# Altium project Remote_sensor.PRJPCB
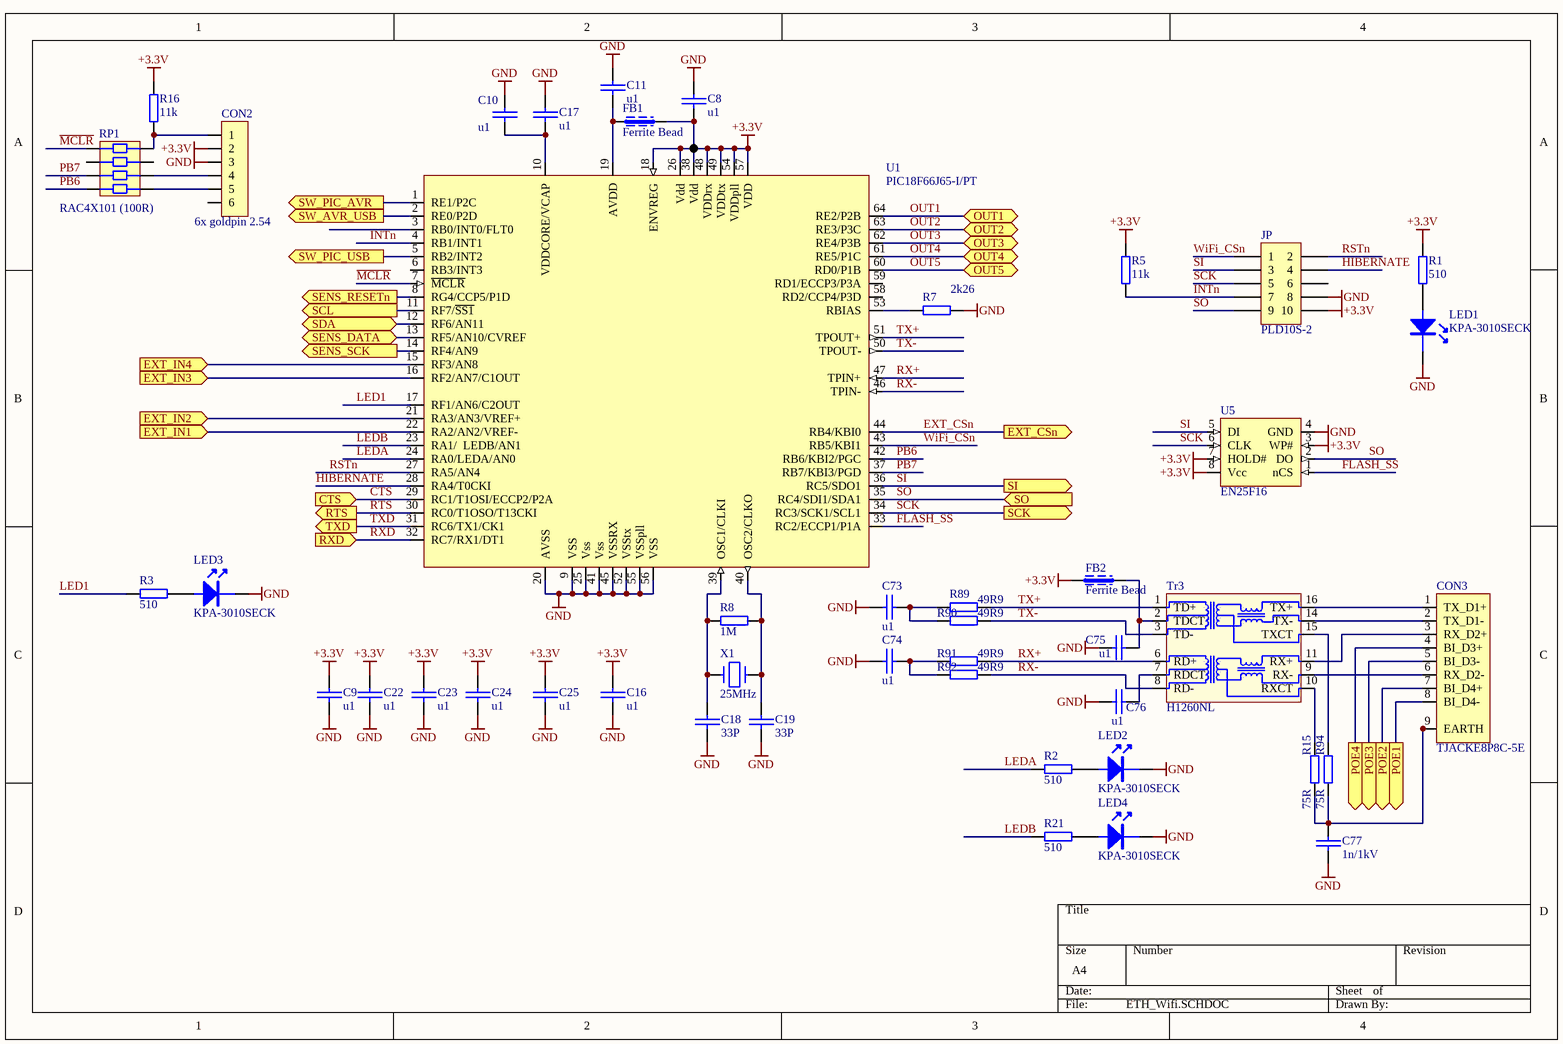
[diagram p0: ETH_Wifi.SCHDOC]
6 sheets, 136 parts. Net scope: hierarchical (ports join the sheet entries above them; power ports are global).
Board file: Weather_Station_ETH.PcbDoc
Sheets:
  ETH_Wifi.SCHDOC
  USB.SchDoc
  supply.SchDoc
  sensors.SchDoc
  IO_SchDoc.SchDoc
  AVR.SchDoc

## Sheet ETH_Wifi.SCHDOC
size A4; SheetNumber: 0; SheetTotal: 0

### Parts
C8  u1  [0603]
C9  u1  [0603]
C10  u1  [0603]
C11  u1  [0603]
C16  u1  [0603]
C17  u1  [0603]
C18  33P  [0603]
C19  33P  [0603]
C22  u1  [0603]
C23  u1  [0603]
C24  u1  [0603]
C25  u1  [0603]
C73  u1  [0603]
C74  u1  [0603]
C75  u1  [0603]
C76  u1  [0603]
C77  1n/1kV  [cap_ceram]
CON2  6x goldpin 2.54  [SIP6]
CON3  TJACKE8P8C-5E  [TJACKE8P8C-5E]
FB1  Ferrite Bead  [0603]
FB2  Ferrite Bead  [0603]
JP  PLD10S-2  [HEADER5X2]
LED1  KPA-3010SECK  [LED_KPA3010]
LED2  KPA-3010SECK  [LED_KPA3010]
LED3  KPA-3010SECK  [LED_KPA3010]
LED4  KPA-3010SECK  [LED_KPA3010]
R1  510  [0603]
R2  510  [0603]
R3  510  [0603]
R5  11k  [0603]
R7  2k26  [0603]
R8  1M  [0603]
R15  75R  [0603]
R16  11k  [0603]
R21  510  [0603]
R89  49R9  [0603]
R90  49R9  [0603]
R91  49R9  [0603]
R92  49R9  [0603]
R94  75R  [0603]
RP1  RAC4X101 (100R)  [CAY-16]
Tr3  H1260NL  [H1260NL]
U1  PIC18F66J65-I/PT  [TQFP64-MAX]
U5  EN25F16  [SO-8L]
X1  25MHz  [HC-49SM]

### Ports
CTS (in), EXT_CSn (out), EXT_IN1 (in), EXT_IN2 (in), EXT_IN3 (in), EXT_IN4 (in), OUT1 (bidir), OUT2 (bidir), OUT3 (bidir), OUT4 (bidir), OUT5 (bidir), POE1 (out), POE2 (out), POE3 (out), POE4 (out), RTS (out), RXD (in), SCK (out), SCL (out), SDA (bidir), SENS_DATA (bidir), SENS_RESETn (out), SENS_SCK (out), SI (out), SO (in), SW_AVR_USB (out), SW_PIC_AVR (out), SW_PIC_USB (out), TXD (out)

### Nets
+3.3V: C8.2 C9.2 C16.1 C22.1 C23.1 C24.1 C25.1 CON2.2 FB1.2 FB2.1 JP.10 R1.1 R5.2 R16.2 U1.18(ENVREG) U1.26(Vdd) U1.38(Vdd) U1.48(VDDrx) U1.49(VDDtx) U1.54(VDDpll) U1.57(VDD) U5.3(WP#) U5.7(HOLD#) U5.8(Vcc)
GND: C8.1 C9.1 C10.1 C11.1 C16.2 C17.1 C18.1 C19.1 C22.2 C23.2 C24.2 C25.2 C73.1 C74.1 C75.1 C76.1 C77.2 CON2.3 JP.8 LED1.K LED2.K LED3.K LED4.K R7.2 U1.9(VSS) U1.20(AVSS) U1.25(Vss) U1.41(Vss) U1.45(VSSRX) U1.52(VSStx) U1.55(VSSpll) U1.56(VSS) U5.4(GND)
CTS: U1.29(RC1/T1OSI/ECCP2/P2A) ; port CTS
EXT_CSn: U1.44(RB4/KBI0) ; port EXT_CSn
FLASH_SS: U1.33(RC2/ECCP1/P1A) U5.1(nCS)
HIBERNATE: JP.4 U1.28(RA4/T0CKI)
INTn: JP.7 R5.1 U1.4(RB1/INT1)
LED1: R3.2 U1.17(RF1/AN6/C2OUT)
LEDA: R2.2 U1.24(RA0/LEDA/AN0)
LEDB: R21.2 U1.23(RA1/__LEDB/AN1)
~{MCLR}: RP1.1 U1.7(~{MCLR})
OUT1: U1.64(RE2/P2B) ; port OUT1
OUT2: U1.63(RE3/P3C) ; port OUT2
OUT3: U1.62(RE4/P3B) ; port OUT3
OUT4: U1.61(RE5/P1C) ; port OUT4
OUT5: U1.60(RD0/P1B) ; port OUT5
PB6: RP1.4 U1.42(RB6/KBI2/PGC)
PB7: RP1.3 U1.37(RB7/KBI3/PGD)
RSTn: JP.2 U1.27(RA5/AN4)
RTS: U1.30(RC0/T1OSO/T13CKI) ; port RTS
RX+: R91.2 Tr3.6(RD+) U1.47(TPIN+)
RX-: R92.2 Tr3.8(RD-) U1.46(TPIN-)
RXD: U1.32(RC7/RX1/DT1) ; port RXD
SCK: JP.5 U1.34(RC3/SCK1/SCL1) U5.6(CLK) ; port SCK
SI: JP.3 U1.36(RC5/SDO1) U5.5(DI) ; port SI
SO: JP.9 U1.35(RC4/SDI1/SDA1) U5.2(DO) ; port SO
TX+: R89.2 Tr3.1(TD+) U1.51(TPOUT+)
TX-: R90.2 Tr3.3(TD-) U1.50(TPOUT-)
TXD: U1.31(RC6/TX1/CK1) ; port TXD
WiFi_CSn: JP.1 U1.43(RB5/KBI1)
NetC10_2: C10.2 C17.2 U1.10(VDDCORE/VCAP)
NetC11_2: C11.2 FB1.1 U1.19(AVDD)
NetC18_2: C18.2 R8.1 U1.39(OSC1/CLKI) X1.1
NetC19_2: C19.2 R8.2 U1.40(OSC2/CLKO) X1.2
NetC73_2: C73.2 R89.1 R90.1
NetC74_2: C74.2 R91.1 R92.1
NetC75_2: C75.2 FB2.2 Tr3.2(TDCT)
NetC76_2: C76.2 Tr3.7(RDCT)
NetC77_1: C77.1 CON3.9(EARTH) CON3.9b CON3.9c CON3.9d R15.1 R94.1
NetCON2_1: CON2.1 R16.1 RP1.8
NetCON2_4: CON2.4 RP1.6
NetCON2_5: CON2.5 RP1.5
NetCON3_1: CON3.1(TX_D1+) Tr3.16(TX+)
NetCON3_2: CON3.2(TX_D1-) Tr3.14(TX-)
NetCON3_3: CON3.3(RX_D2+) Tr3.11(RX+)
NetCON3_4: CON3.4(BI_D3+) ; port POE4
NetCON3_5: CON3.5(BI_D3-) ; port POE3
NetCON3_6: CON3.6(RX_D2-) Tr3.9(RX-)
NetCON3_7: CON3.7(BI_D4+) ; port POE2
NetCON3_8: CON3.8(BI_D4-) ; port POE1
NetLED1_A: LED1.A R1.2
NetLED2_A: LED2.A R2.1
NetLED3_A: LED3.A R3.1
NetLED4_A: LED4.A R21.1
NetR7_1: R7.1 U1.53(RBIAS)
NetR15_2: R15.2 Tr3.10(RXCT)
NetR94_2: R94.2 Tr3.15(TXCT)
NetU1_1: U1.1(RE1/P2C) ; port SW_PIC_AVR
NetU1_2: U1.2(RE0/P2D) ; port SW_AVR_USB
NetU1_5: U1.5(RB2/INT2) ; port SW_PIC_USB
NetU1_8: U1.8(RG4/CCP5/P1D) ; port SENS_RESETn
NetU1_11: U1.11(RF7/~{SS1}) ; port SCL
NetU1_12: U1.12(RF6/AN11) ; port SDA
NetU1_13: U1.13(RF5/AN10/CVREF) ; port SENS_DATA
NetU1_14: U1.14(RF4/AN9) ; port SENS_SCK
NetU1_15: U1.15(RF3/AN8) ; port EXT_IN4
NetU1_16: U1.16(RF2/AN7/C1OUT) ; port EXT_IN3
NetU1_21: U1.21(RA3/AN3/VREF+) ; port EXT_IN2
NetU1_22: U1.22(RA2/AN2/VREF-) ; port EXT_IN1

Not connected (* = marked no-connect by the designer): CON2 6; JP 6; RP1 2 7; U1 3(RB0/INT0/FLT0) 6(RB3/INT3) 58(RD2/CCP4/P3D) 59(RD1/ECCP3/P3A)

### Library data of the parts
C8-C11 C16-C19 C22-C25 C73-C76 = CAP_SMD: Capacitor SMD
C77 = CAP: Capacitor
CON2 = CON6
CON3 = CON_RJ45_shielded: RJ 45 connector (Maritex)
FB1 FB2 = L_FERRITE_BEAD
JP = CON_HEADER 5X2: Goldpin 2.54mm
LED1-LED4 = LED_SMD_90deg: LED (TME)
R1-R3 R5 R7 R8 R15 R16 R21 R89-R92 R94 = RES_SMD: SMD Resistor
RP1 = CAY-16: Resistor network 1206 (4x0402) Maritex RAC4Xxxx
Tr3 = TR_H1260NL: ethernet trafo (TME)
U1 = PIC18F66J60
U5 = MEM_EN25F16: FLASH (maritex)
X1 = CRYSTAL: Crystal oscillator

## Sheet USB.SchDoc
size A4
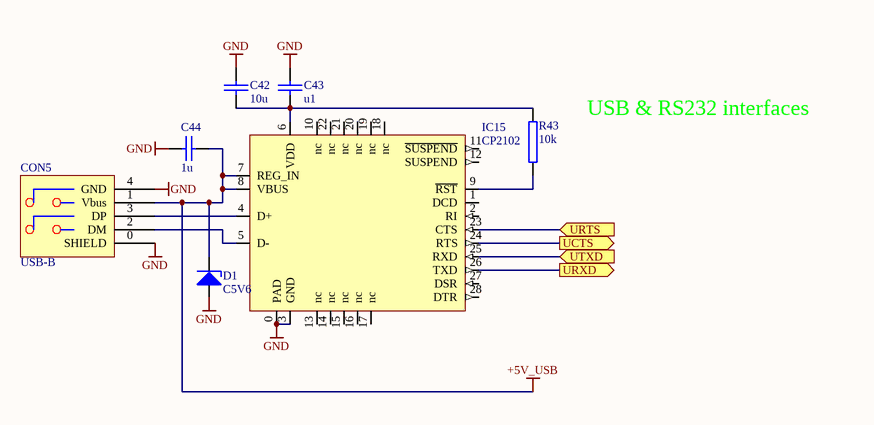
[diagram p1: USB.SchDoc]

### Parts
(Parts that share a designator on the sheet are numbered #1, #2 ... from top to bottom, then left to right.)
C42  10u  [1206]
C43  u1  [0603]
C44  1u  [0805]
CON5  USB-B  [USBB-G]
D1#1  C5V6  [SOD80]
IC15  CP2102  [QFN28]
R43  10k  [0603]

### Ports
UCTS (out), URTS (in), URXD (out), UTXD (in)

### Nets
+5V_USB: C44.2 CON5.1(Vbus) D1#1.K IC15.7(REG_IN) IC15.8(VBUS)
GND: C42.2 C43.2 C44.1 CON5.0(SHIELD) CON5.4(GND) D1#1.A IC15.0(PAD) IC15.3(GND)
NetC42_1: C42.1 C43.1 IC15.6(VDD) R43.1
NetCON5_2: CON5.2(DM) IC15.5(D-)
NetCON5_3: CON5.3(DP) IC15.4(D+)
NetIC15_9: IC15.9(~{RST}) R43.2
NetIC15_23: IC15.23(CTS) ; port URTS
NetIC15_24: IC15.24(RTS) ; port UCTS
NetIC15_25: IC15.25(RXD) ; port UTXD
NetIC15_26: IC15.26(TXD) ; port URXD

Not connected (* = marked no-connect by the designer): IC15 1(DCD) 2(RI) 10(nc) 11(~{SUSPEND}) 12(SUSPEND) 13(nc) 14(nc) 15(nc) 16(nc) 17(nc) 18(nc) 19(nc) 20(nc) 21(nc) 22(nc) 27(DSR) 28(DTR)

### Notes on the sheet
- USB & RS232 interfaces

### Library data of the parts
C42-C44 = CAP_SMD: Capacitor SMD
CON5 = USB_CON_B: USB connector B type (TME)
D1#1 = ZENER1: Zener Diode
R43 = RES2: Resistor

## Sheet supply.SchDoc
size A4
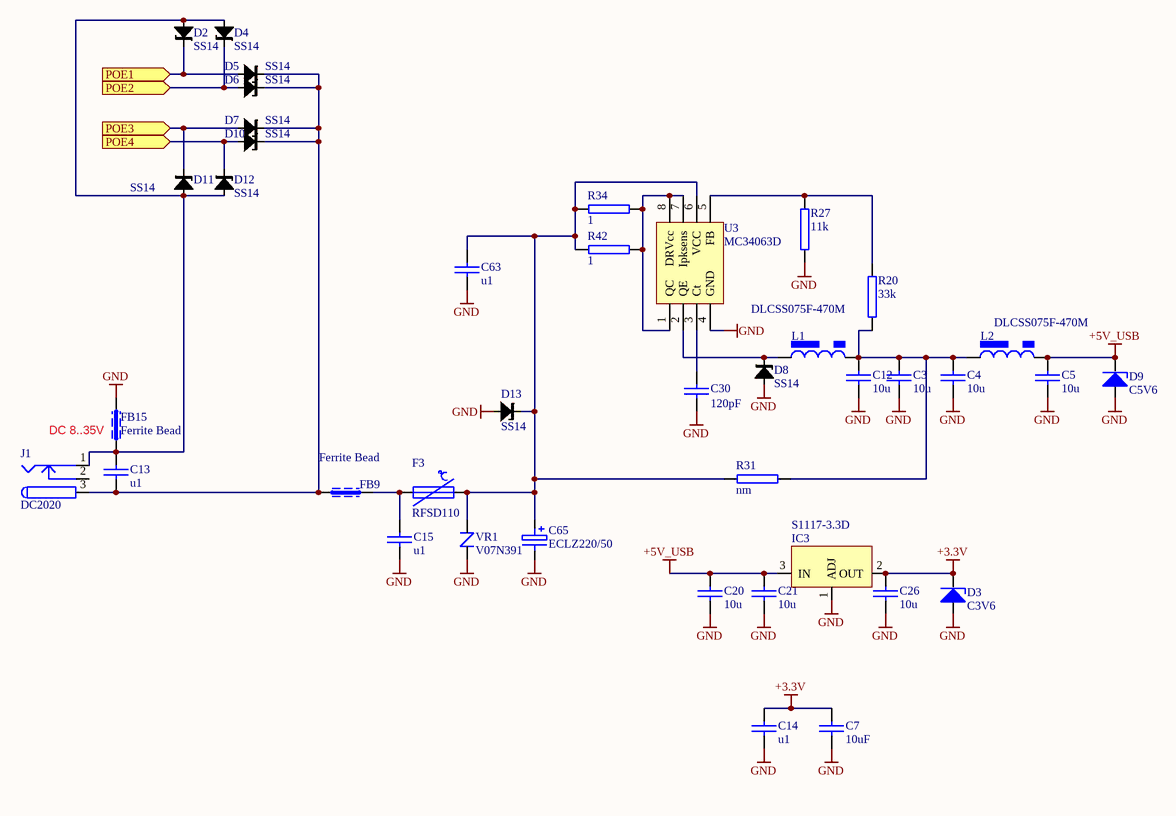
[diagram p2: supply.SchDoc]

### Parts
(Parts that share a designator on the sheet are numbered #1, #2 ... from top to bottom, then left to right.)
C3  10u  [0805]
C4  10u  [0805]
C5  10u  [0805]
C7  10uF  [0805]
C12  10u  [0805]
C13  u1  [0603]
C14  u1  [0603]
C15  u1  [0603]
C20  10u  [0805]
C21  10u  [0805]
C26  10u  [0805]
C30  120pF  [0603]
C63  u1  [0603]
C65  ECLZ220/50  [CAP_SMT_EL_10mm_G]
D2  SS14  [DO-214AC/SMA]
D3  C3V6  [SOD80]
D4  SS14  [DO-214AC/SMA]
D5  SS14  [DO-214AC/SMA]
D6  SS14  [DO-214AC/SMA]
D7  SS14  [DO-214AC/SMA]
D8  SS14  [DO-214AC/SMA]
D9  C5V6  [SOD80]
D10  SS14  [DO-214AC/SMA]
D11  SS14  [DO-214AC/SMA]
D12#1  SS14  [DO-214AC/SMA]
D13  SS14  [DO-214AC/SMA]
F3  RFSD110  [PTC_SMD_1812]
FB9  Ferrite Bead  [0603]
FB15  Ferrite Bead  [0603]
IC3  S1117-3.3D  [TO-252]
J1  DC2020  [DC2020]
L1  DLCSS075F-470M  [choke_DLSD75]
L2  DLCSS075F-470M  [choke_DLSD75]
R20  33k  [0603]
R27  11k  [0603]
R31  nm  [0603]
R34  1  [0603]
R42  1  [0603]
U3  MC34063D  [so-8]
VR1  V07N391  [Varistor_7mm]

### Ports
POE1 (in), POE2 (in), POE3 (in), POE4 (in)

### Nets
+3.3V: C7.1 C14.1 C26.1 D3.K IC3.2(OUT)
+5V_USB: C5.1 C20.1 C21.1 D9.K IC3.3(IN) L2.2
GND: C3.2 C4.2 C5.2 C7.2 C12.2 C14.2 C15.2 C20.2 C21.2 C26.2 C30.1 C63.2 C65.2 D3.A D8.A D9.A D13.A FB15.2 IC3.1(ADJ) R27.2 U3.4(GND) VR1.2
NetC3_1: C3.1 C4.1 C12.1 L1.2 L2.1 R20.2 R31.2
NetC13_1: C13.1 D2.A D4.A D11.A D12#1.A FB15.1 J1.1
NetC13_2: C13.2 D5.K D6.K D7.K D10.K FB9.1 J1.3
NetC15_1: C15.1 F3.1 FB9.2
NetC30_2: C30.2 U3.3(Ct)
NetC63_1: C63.1 C65.1 D13.K F3.2 R31.1 R34.1 R42.1 U3.6(VCC) VR1.1
NetD2_K: D2.K D5.A ; port POE1
NetD4_K: D4.K D6.A ; port POE2
NetD7_A: D7.A D11.K ; port POE3
NetD8_K: D8.K L1.1 U3.2(QE)
NetD10_A: D10.A D12#1.K ; port POE4
NetR20_1: R20.1 R27.1 U3.5(FB)
NetR34_2: R34.2 R42.2 U3.1(QC) U3.7(Ipksens) U3.8(DRVcc)

Not connected (* = marked no-connect by the designer): J1 2

### Notes on the sheet
- (near FB15) DC 8..35V

### Library data of the parts
C3-C5 C7 C12-C15 C20 C21 C26 C30 C63 = CAP_SMD: Capacitor SMD
C65 = CAP_ELECTRO_SMD: Electrolytic Capacitor
D2 D4-D8 D10 D11 D12#1 D13 = shottky_SS14_18: shottky diode (Maritex)
D3 D9 = ZENER1: Zener Diode
F3 = F_POLYSWITCH: polymer FUSE
FB9 FB15 = L_FERRITE_BEAD
IC3 = REG_S1117-3.3D: Voltage Regulator
J1 = CON_DC_JACK_TH: Low Voltage Power Supply Connector (maritex); Published: 17-Dec-2003; Datasheet: Latest Revision: 09-May-2002; Publisher: Altium Limited
L1 L2 = L_POWER_INDUCTOR_CSS075F: inductor
R20 R27 R31 R34 R42 = RES_SMD: SMD Resistor
U3 = MC34063A
VR1 = Varistor V07N: varistor 7mm (Maritex)

## Sheet sensors.SchDoc
size A4
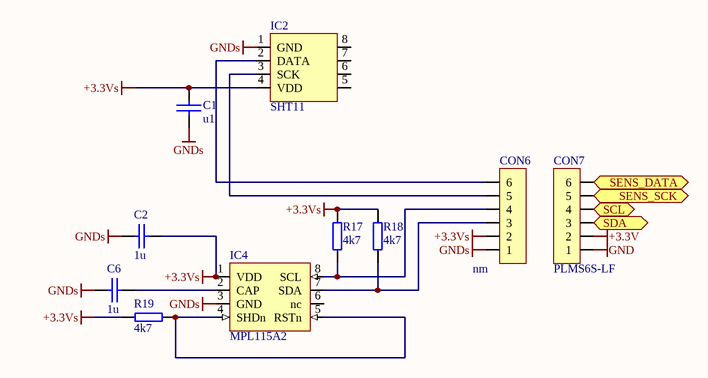
[diagram p3: sensors.SchDoc]

### Parts
C1  u1  [0603]
C2  1u  [0603]
C6  1u  [0603]
CON6  nm  [PLMS6R-2LF]
CON7  PLMS6S-LF  [PLMS6R-2LF]
IC2  SHT11  [SHT11]
IC4  MPL115A2  [LGA8]
R17  4k7  [0603]
R18  4k7  [0603]
R19  4k7  [0603]

### Ports
SCL (in), SDA (bidir), SENS_DATA (bidir), SENS_SCK (in)

### Nets
+3.3V: CON7.2
+3.3Vs: C1.1 C2.2 CON6.2 IC2.4(VDD) IC4.1(VDD) R17.2 R18.2 R19.2
GND: CON7.1
GNDs: C1.2 C2.1 C6.1 CON6.1 IC2.1(GND) IC4.3(GND)
NetC6_2: C6.2 IC4.2(CAP)
NetCON6_3: CON6.3 IC4.7(SDA) R18.1
NetCON6_4: CON6.4 IC4.8(SCL) R17.1
NetCON6_5: CON6.5 IC2.3(SCK)
NetCON6_6: CON6.6 IC2.2(DATA)
NetCON7_3: CON7.3 ; port SDA
NetCON7_4: CON7.4 ; port SCL
NetCON7_5: CON7.5 ; port SENS_SCK
NetCON7_6: CON7.6 ; port SENS_DATA
NetIC4_4: IC4.4(SHDn) IC4.5(RSTn) R19.1

Not connected (* = marked no-connect by the designer): IC2 5 6 7 8; IC4 6(nc)

### Library data of the parts
C1 C2 C6 = CAP_SMD: Capacitor SMD
CON6 CON7 = CON_6_goldpin_RA_2mm: 2mm RA goldpin
IC2 = SHT11: temp/humidity sensor
IC4 = SENS_MPL115A2: Miniature I2C Digital Barometer
R17-R19 = RES_SMD: SMD Resistor

## Sheet IO_SchDoc.SchDoc
size A4
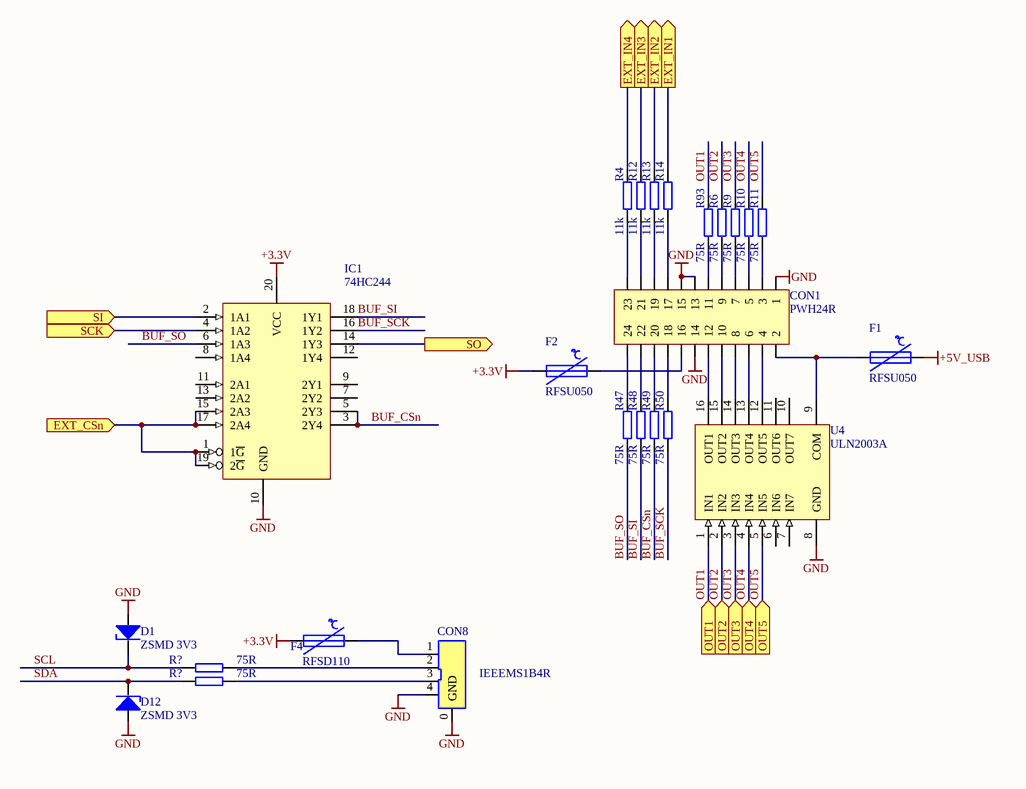
[diagram p4: IO_SchDoc.SchDoc]

### Parts
(Parts that share a designator on the sheet are numbered #1, #2 ... from top to bottom, then left to right.)
CON1  PWH24R  [CON_PWH24R-LF]
CON8  IEEEMS1B4R  [CON_IEEEMS1B4R]
D1#2  ZSMD 3V3  [SOD80]
D12#2  ZSMD 3V3  [SOD80]
F1  RFSU050  [PTC_SMD_1812]
F2  RFSU050  [PTC_SMD_1812]
F4  RFSD110  [PTC_SMD_1812]
IC1  74HC244  [tssop20]
R4  11k  [0603]
R6  75R  [0603]
R9  75R  [0603]
R10  75R  [0603]
R11  75R  [0603]
R12  11k  [0603]
R13  11k  [0603]
R14  11k  [0603]
R47  75R  [0603]
R48  75R  [0603]
R49  75R  [0603]
R50  75R  [0603]
R93  75R  [0603]
R?#1  75R  [0603]
R?#2  75R  [0603]
U4  ULN2003A  [So-16]

### Ports
EXT_CSn (in), EXT_IN1 (out), EXT_IN2 (out), EXT_IN3 (out), EXT_IN4 (out), OUT1 (in), OUT2 (in), OUT3 (in), OUT4 (in), OUT5 (in), SCK (in), SI (in), SO (out)

### Nets
+3.3V: F2.1 F4.1 IC1.20(VCC)
+5V_USB: F1.2
GND: CON1.1 CON1.13 CON1.14 CON1.15 CON8.0(GND) CON8.4 D1#2.A D12#2.A IC1.10(GND) U4.8(GND)
BUF_CSn: IC1.3(2Y4) IC1.5(2Y3) R49.2
BUF_SCK: IC1.16(1Y2) R50.2
BUF_SI: IC1.18(1Y1) R48.2
BUF_SO: IC1.6(1A3) R47.2
OUT1: R93.2 U4.1(IN1) ; port OUT1
OUT2: R6.2 U4.2(IN2) ; port OUT2
OUT3: R9.2 U4.3(IN3) ; port OUT3
OUT4: R10.2 U4.4(IN4) ; port OUT4
OUT5: R11.2 U4.5(IN5) ; port OUT5
SCL: D1#2.K R?#1.1
SDA: D12#2.K R?#2.1
NetCON1_2: CON1.2 F1.1 U4.9(COM)
NetCON1_3: CON1.3 R11.1
NetCON1_4: CON1.4 U4.12(OUT5)
NetCON1_5: CON1.5 R10.1
NetCON1_6: CON1.6 U4.13(OUT4)
NetCON1_7: CON1.7 R9.1
NetCON1_8: CON1.8 U4.14(OUT3)
NetCON1_9: CON1.9 R6.1
NetCON1_10: CON1.10 U4.15(OUT2)
NetCON1_11: CON1.11 R93.1
NetCON1_12: CON1.12 U4.16(OUT1)
NetCON1_16: CON1.16 F2.2
NetCON1_17: CON1.17 R14.2
NetCON1_18: CON1.18 R50.1
NetCON1_19: CON1.19 R13.2
NetCON1_20: CON1.20 R49.1
NetCON1_21: CON1.21 R12.2
NetCON1_22: CON1.22 R48.1
NetCON1_23: CON1.23 R4.2
NetCON1_24: CON1.24 R47.1
NetCON8_1: CON8.1 F4.2
NetCON8_2: CON8.2 R?#1.2
NetCON8_3: CON8.3 R?#2.2
NetIC1_1: IC1.1(1~{G}) IC1.15(2A3) IC1.17(2A4) IC1.19(2~{G}) ; port EXT_CSn
NetIC1_2: IC1.2(1A1) ; port SI
NetIC1_4: IC1.4(1A2) ; port SCK
NetIC1_14: IC1.14(1Y3) ; port SO
NetR4_1: R4.1 ; port EXT_IN4
NetR12_1: R12.1 ; port EXT_IN3
NetR13_1: R13.1 ; port EXT_IN2
NetR14_1: R14.1 ; port EXT_IN1

Not connected (* = marked no-connect by the designer): IC1 7(2Y2) 8(1A4) 9(2Y1) 11(2A1) 12(1Y4) 13(2A2); U4 6(IN6) 7(IN7) 10(OUT7) 11(OUT6)

### Library data of the parts
CON1 = CON_crimp_24p_RA_TH_3mm: 3mm crimped terminal (Maritex)
CON8 = CON_USB_mini: CON_IEEE1394_mini
D1#2 D12#2 = D_ZENER: Zener Diode
F1 F2 = F_POLYSWITCH: polymer FUSE
F4 = F_POLYSWITCH: polymer FUSE (Maritex)
IC1 = 74HC244: TTL BUS tristate
R4 R6 R9-R14 R47-R50 R93 R?#1 R?#2 = RES_SMD: SMD Resistor
U4 = DRV_ULN2003A: High-Voltage, High-Current Darlington Array; Package Information: Latest Revision: 1998; Code - JEDEC: MS-001-BB; Published: 13-Oct-2000; Revision: 17-Jul-2002: Re-released for DXP Platform.; Datasheet: Latest Revision: 1998; Package Reference: A16; Publisher: Altium Limited

## Sheet AVR.SchDoc
size A4
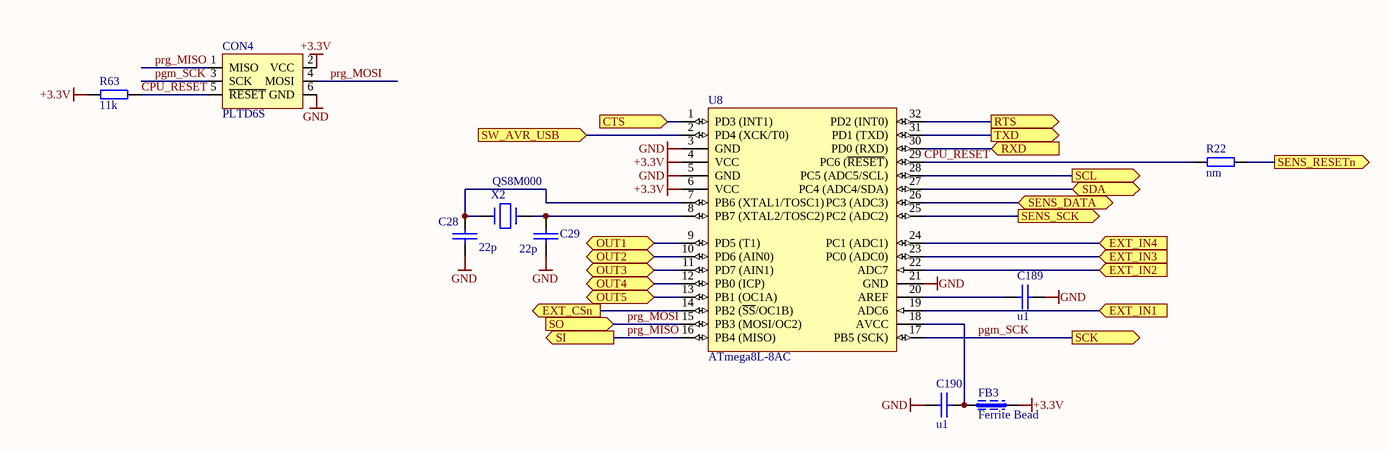
[diagram p5: AVR.SchDoc]

### Parts
C28  22p  [0603]
C29  22p  [0603]
C189  u1  [0603]
C190  u1  [0603]
CON4  PLTD6S  [PLTD6S]
FB3  Ferrite Bead  [0603]
R22  nm  [0603]
R63  11k  [0603]
U8  ATmega8L-8AC  [QFP32a]
X2  QS8M000  [HC-49SM]

### Ports
CTS (in), EXT_CSn (out), EXT_IN1 (in), EXT_IN2 (in), EXT_IN3 (in), EXT_IN4 (in), OUT1 (bidir), OUT2 (bidir), OUT3 (bidir), OUT4 (bidir), OUT5 (bidir), RTS (out), RXD (in), SCK (out), SCL (out), SDA (bidir), SENS_DATA (bidir), SENS_RESETn (out), SENS_SCK (out), SI (out), SO (in), SW_AVR_USB (in), TXD (out)

### Nets
+3.3V: CON4.2(VCC) FB3.2 R63.2 U8.4(VCC) U8.6(VCC)
GND: C28.1 C29.1 C189.2 C190.2 CON4.6(GND) U8.3(GND) U8.5(GND) U8.21(GND)
CPU_RESET: CON4.5(~{RESET}) R22.2 R63.1 U8.29(PC6_(~{RESET}))
pgm_SCK: CON4.3(SCK) U8.17(PB5_(SCK)) ; port SCK
prg_MISO: CON4.1(MISO) U8.16(PB4_(MISO)) ; port SI
prg_MOSI: CON4.4(MOSI) U8.15(PB3_(MOSI/OC2)) ; port SO
NetC28_2: C28.2 U8.7(PB6_(XTAL1/TOSC1)) X2.1
NetC29_2: C29.2 U8.8(PB7_(XTAL2/TOSC2)) X2.2
NetC189_1: C189.1 U8.20(AREF)
NetC190_1: C190.1 FB3.1 U8.18(AVCC)
NetR22_1: R22.1 ; port SENS_RESETn
NetU8_1: U8.1(PD3_(INT1)) ; port CTS
NetU8_2: U8.2(PD4_(XCK/T0)) ; port SW_AVR_USB
NetU8_9: U8.9(PD5_(T1)) ; port OUT1
NetU8_10: U8.10(PD6_(AIN0)) ; port OUT2
NetU8_11: U8.11(PD7_(AIN1)) ; port OUT3
NetU8_12: U8.12(PB0_(ICP)) ; port OUT4
NetU8_13: U8.13(PB1_(OC1A)) ; port OUT5
NetU8_14: U8.14(PB2_(~{SS}/OC1B)) ; port EXT_CSn
NetU8_19: U8.19(ADC6) ; port EXT_IN1
NetU8_22: U8.22(ADC7) ; port EXT_IN2
NetU8_23: U8.23(PC0_(ADC0)) ; port EXT_IN3
NetU8_24: U8.24(PC1_(ADC1)) ; port EXT_IN4
NetU8_25: U8.25(PC2_(ADC2)) ; port SENS_SCK
NetU8_26: U8.26(PC3_(ADC3)) ; port SENS_DATA
NetU8_27: U8.27(PC4_(ADC4/SDA)) ; port SDA
NetU8_28: U8.28(PC5_(ADC5/SCL)) ; port SCL
NetU8_30: U8.30(PD0_(RXD)) ; port RXD
NetU8_31: U8.31(PD1_(TXD)) ; port TXD
NetU8_32: U8.32(PD2_(INT0)) ; port RTS

### Library data of the parts
C28 C29 C189 C190 = CAP_SMD: Capacitor SMD
CON4 = CON_ISP
FB3 = L_FERRITE_BEAD
R22 R63 = RES_SMD: SMD Resistor
U8 = ATmega8-16AI: 8-Bit AVR Microcontroller with 8K Bytes of In-System Programmable Flash Memory; Package Information: Latest Revision: revB, Oct-2001; Code - JEDEC: MS-026-ABA; Published: 17-Sep-2003; Datasheet: Latest Revision: 2486H-AVR-09/02; Package Reference: 32A; Publisher: Altium Limited
X2 = CRYSTAL: Crystal oscillator

## Nets that join several sheets
+3.3V: ETH_Wifi (24 pins), supply (5 pins), sensors (CON7.2), IO_SchDoc (F2.1 F4.1 IC1.20), AVR (5 pins)
+5V_USB: USB (5 pins), supply (6 pins), IO_SchDoc (F1.2)
GND: ETH_Wifi (33 pins), USB (8 pins), supply (22 pins), sensors (CON7.1), IO_SchDoc (10 pins), AVR (8 pins)

## Assembly variants
FULL ETH + USB: not fitted R22 R26 R32 R33 R35 R36 R37 R38 R39 R40 R41 R44 R45 R46 R51 R52 R53 R54 R55 R56 R57 R58 R59 R60 R61 R62